# Altium schematic sheet FPGA_part2.SchDoc
size A4
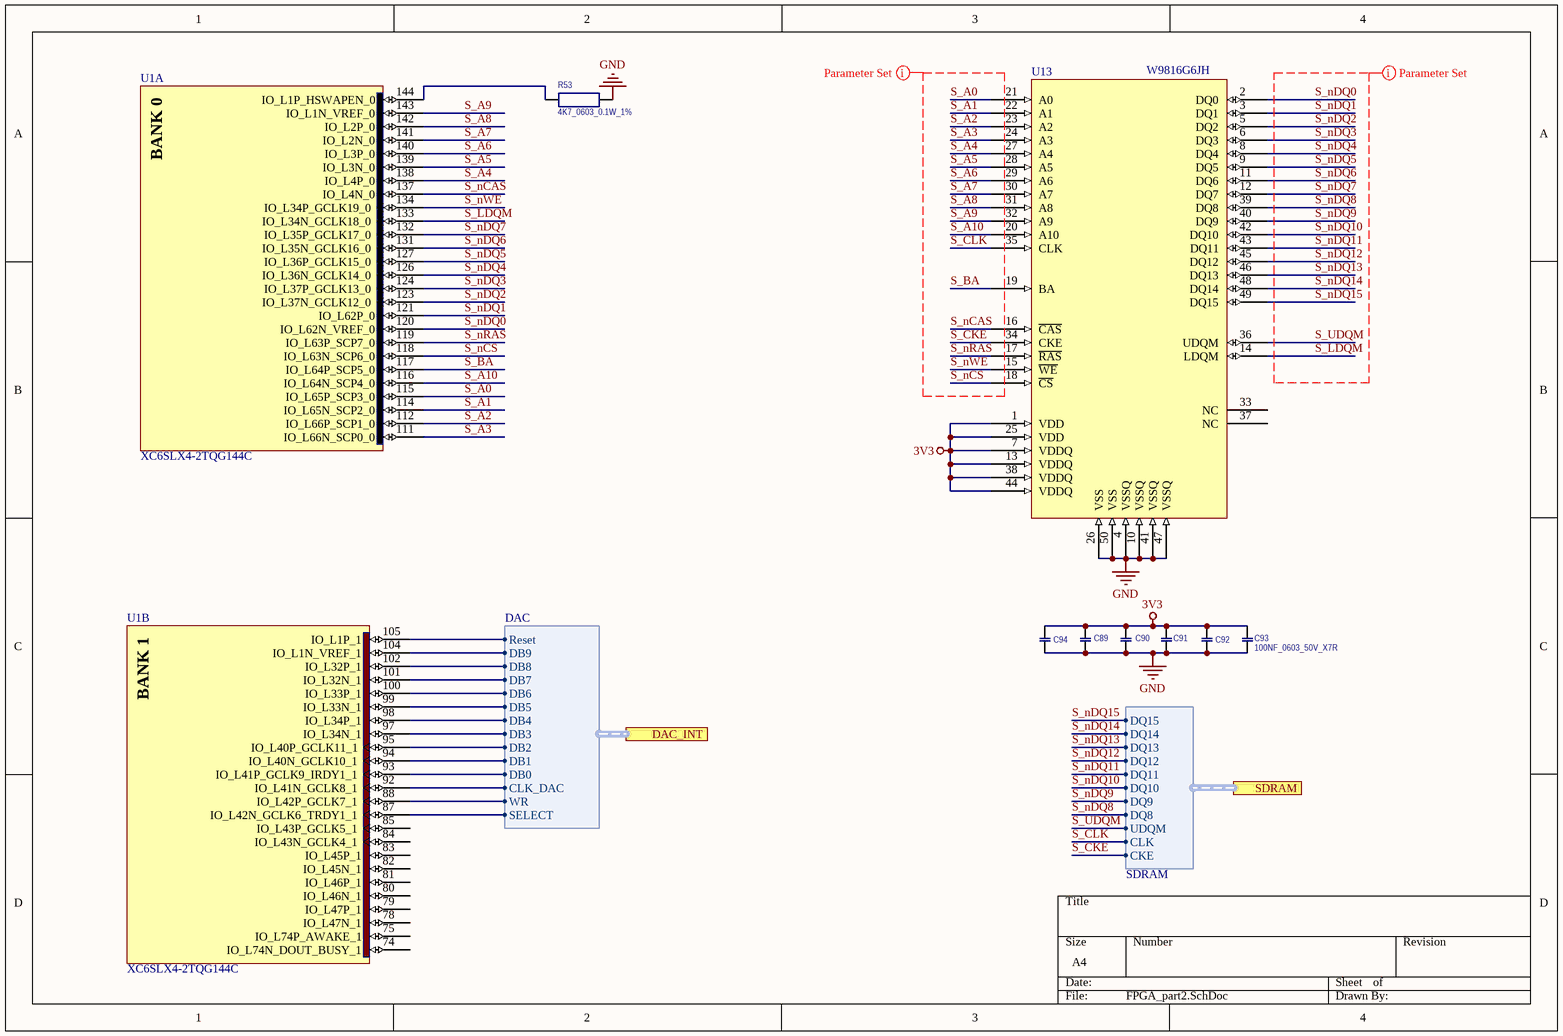
[diagram p0: FPGA_part2.SchDoc]

## Parts
C89  100NF_0603_50V_X7R  [CAP0603]  (value not drawn)
C90  100NF_0603_50V_X7R  [CAP0603]  (value not drawn)
C91  100NF_0603_50V_X7R  [CAP0603]  (value not drawn)
C92  100NF_0603_50V_X7R  [CAP0603]  (value not drawn)
C93  100NF_0603_50V_X7R  [CAP0603]
C94  100NF_0603_50V_X7R  [CAP0603]  (value not drawn)
R53  4K7_0603_0.1W_1%  [R0603]
U1  XC6SLX4-2TQG144C  [TQG144_L]  (parts A,B of 7)
U13  W9816G6JH  [SSOP50]

## Ports
DAC_INT (harness DAC), SDRAM (harness SDRAM)

## Harnesses
DAC: CLK_DAC, DB0, DB1, DB2, DB3, DB4, DB5, DB6, DB7, DB8, DB9, Reset, SELECT, WR
SDRAM: DQ15, DQ8, DQ9, DQ10, DQ11, DQ12, DQ13, DQ14, UDQM, CLK, CKE

## Nets
3V3: C89.1 C90.1 C91.1 C92.1 C93.1 C94.1 U13.1(VDD) U13.7(VDDQ) U13.13(VDDQ) U13.25(VDD) U13.38(VDDQ) U13.44(VDDQ)
GND: C89.2 C90.2 C91.2 C92.2 C93.2 C94.2 R53.2 U13.4(VSSQ) U13.10(VSSQ) U13.26(VSS) U13.41(VSSQ) U13.47(VSSQ) U13.50(VSS)
S_A0: U1.115(IO_L65P_SCP3_0) U13.21(A0)
S_A1: U1.114(IO_L65N_SCP2_0) U13.22(A1)
S_A2: U1.112(IO_L66P_SCP1_0) U13.23(A2)
S_A3: U1.111(IO_L66N_SCP0_0) U13.24(A3)
S_A4: U1.138(IO_L4P_0) U13.27(A4)
S_A5: U1.139(IO_L3N_0) U13.28(A5)
S_A6: U1.140(IO_L3P_0) U13.29(A6)
S_A7: U1.141(IO_L2N_0) U13.30(A7)
S_A8: U1.142(IO_L2P_0) U13.31(A8)
S_A9: U1.143(IO_L1N_VREF_0) U13.32(A9)
S_A10: U1.116(IO_L64N_SCP4_0) U13.20(A10)
S_BA: U1.117(IO_L64P_SCP5_0) U13.19(BA)
S_CKE: U13.34(CKE) ; port SDRAM.CKE
S_CLK: U13.35(CLK) ; port SDRAM.CLK
S_LDQM: U1.133(IO_L34N_GCLK18_0) U13.14(LDQM)
S_nCAS: U1.137(IO_L4N_0) U13.16(~{CAS})
S_nCS: U1.118(IO_L63N_SCP6_0) U13.18(~{CS})
S_nDQ0: U1.120(IO_L62N_VREF_0) U13.2(DQ0)
S_nDQ1: U1.121(IO_L62P_0) U13.3(DQ1)
S_nDQ2: U1.123(IO_L37N_GCLK12_0) U13.5(DQ2)
S_nDQ3: U1.124(IO_L37P_GCLK13_0) U13.6(DQ3)
S_nDQ4: U1.126(IO_L36N_GCLK14_0) U13.8(DQ4)
S_nDQ5: U1.127(IO_L36P_GCLK15_0) U13.9(DQ5)
S_nDQ6: U1.131(IO_L35N_GCLK16_0) U13.11(DQ6)
S_nDQ7: U1.132(IO_L35P_GCLK17_0) U13.12(DQ7)
S_nDQ8: U13.39(DQ8) ; port SDRAM.DQ8
S_nDQ9: U13.40(DQ9) ; port SDRAM.DQ9
S_nDQ10: U13.42(DQ10) ; port SDRAM.DQ10
S_nDQ11: U13.43(DQ11) ; port SDRAM.DQ11
S_nDQ12: U13.45(DQ12) ; port SDRAM.DQ12
S_nDQ13: U13.46(DQ13) ; port SDRAM.DQ13
S_nDQ14: U13.48(DQ14) ; port SDRAM.DQ14
S_nDQ15: U13.49(DQ15) ; port SDRAM.DQ15
S_nRAS: U1.119(IO_L63P_SCP7_0) U13.17(~{RAS})
S_nWE: U1.134(IO_L34P_GCLK19_0) U13.15(~{WE})
S_UDQM: U13.36(UDQM) ; port SDRAM.UDQM
NetR53_1: R53.1 U1.144(IO_L1P_HSWAPEN_0)
NetU1_87: U1.87(IO_L42N_GCLK6_TRDY1_1) ; port DAC_INT.SELECT
NetU1_88: U1.88(IO_L42P_GCLK7_1) ; port DAC_INT.WR
NetU1_92: U1.92(IO_L41N_GCLK8_1) ; port DAC_INT.CLK_DAC
NetU1_93: U1.93(IO_L41P_GCLK9_IRDY1_1) ; port DAC_INT.DB0
NetU1_94: U1.94(IO_L40N_GCLK10_1) ; port DAC_INT.DB1
NetU1_95: U1.95(IO_L40P_GCLK11_1) ; port DAC_INT.DB2
NetU1_97: U1.97(IO_L34N_1) ; port DAC_INT.DB3
NetU1_98: U1.98(IO_L34P_1) ; port DAC_INT.DB4
NetU1_99: U1.99(IO_L33N_1) ; port DAC_INT.DB5
NetU1_100: U1.100(IO_L33P_1) ; port DAC_INT.DB6
NetU1_101: U1.101(IO_L32N_1) ; port DAC_INT.DB7
NetU1_102: U1.102(IO_L32P_1) ; port DAC_INT.DB8
NetU1_104: U1.104(IO_L1N_VREF_1) ; port DAC_INT.DB9
NetU1_105: U1.105(IO_L1P_1) ; port DAC_INT.Reset

Not connected (* = marked no-connect by the designer): U1 74(IO_L74N_DOUT_BUSY_1) 75(IO_L74P_AWAKE_1) 78(IO_L47N_1) 79(IO_L47P_1) 80(IO_L46N_1) 81(IO_L46P_1) 82(IO_L45N_1) 83(IO_L45P_1) 84(IO_L43N_GCLK4_1) 85(IO_L43P_GCLK5_1); U13 33(NC) 37(NC)

## Layout directives
net class SDRAM: S_A0, S_A1, S_A2, S_A3, S_A4, S_A5, S_A6, S_A7, S_A8, S_A9, S_A10, S_BA, S_CKE, S_CLK, S_LDQM, S_nCAS, S_nCS, S_nDQ0, S_nDQ1, S_nDQ2, S_nDQ3, S_nDQ4, S_nDQ5, S_nDQ6, S_nDQ7, S_nDQ8, S_nDQ9, S_nDQ10, S_nDQ11, S_nDQ12, S_nDQ13, S_nDQ14, S_nDQ15, S_nRAS, S_nWE, S_UDQM

## Notes on the sheet
- (in symbol XC6SLX4-2TQG144C, part A) BANK 0
- (in symbol XC6SLX4-2TQG144C, part B) BANK 1

## Library data of the parts
C89-C94 = 100NF_0603_50V_X7R: 128-8255    Capacitor MLC-X7R_0603_100NF_10%_50V; C0603C104K5RAC; KEMET; RoHS=Yes
R53 = 4K7_0603_0.1W_1%: 146-9807    RESISTOR MF_0603_4K7_0.1W_1%_75V; CRCW06034K70FKEA; VISHAY; RoHS=Yes
U1 = XC6SLX4-2TQG144C: Spartan-6 LX 1.2V FPGA, 102 User I/Os, 144-Pin TQFP (0.5mm Pitch), Speed Grade 2, Commercial Grade, Pb-Free; Published: 1-Jul-2010; DatasheetVersion: ver1.6, Nov-2010; PackageVersion: ver1.2, Jun-2004; PackageReference: TQG144; Publisher: Altium Limited; PackageDescription: 144-Pin Thin Quad Flat Pack (TQG144) - Pb-Free; Supplier 1: Digi-Key; Supplier Part Number 1: XC6SLX4-2TQG144C-ND; Code_JEDEC: MS-026-BFB; ComponentLink1Description: Manufacturer Link; ComponentLink1URL: http://www.xilinx.com; ComponentLink2Description: Spartan-6 Datasheet; ComponentLink2URL: http://www.xilinx.com/support/documentation/data_sheets/ds160.pdf; ComponentLink3Description: Spartan-6 Documents; ComponentLink3URL: http://www.xilinx.com/support/documentation/spartan-6.htm; ComponentLink4Description: Xilinx.com Home; ComponentLink4URL: http://www.xilinx.com